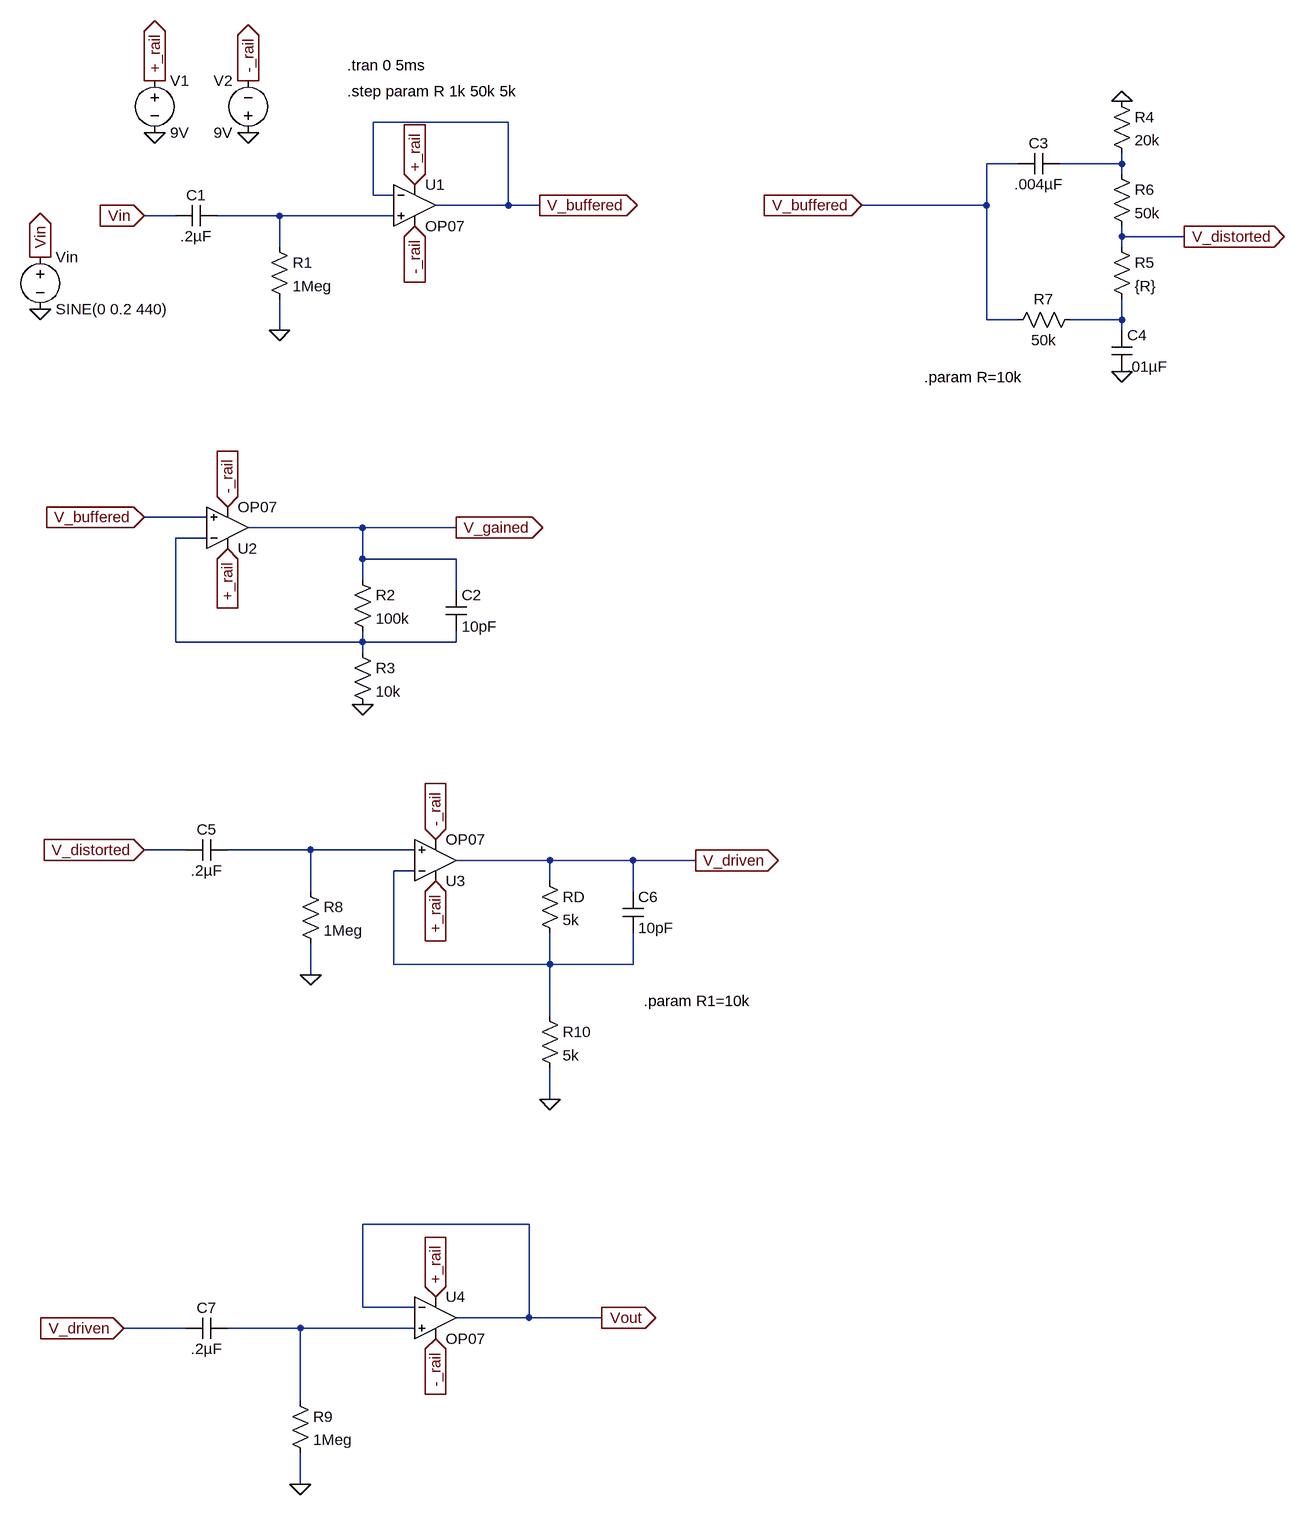
[diagram p0: schematic Overall Schematic.asc]
Overall Schematic.asc, the LTspice schematic file:
Version 4
SHEET 1 1952 2320
WIRE 736 208 528 208
WIRE 1520 272 1472 272
WIRE 1680 272 1680 256
WIRE 1680 272 1584 272
WIRE 1680 288 1680 272
WIRE 528 320 528 208
WIRE 560 320 528 320
WIRE 736 336 736 208
WIRE 736 336 624 336
WIRE 784 336 736 336
WIRE 1472 336 1472 272
WIRE 1472 336 1280 336
WIRE 224 352 176 352
WIRE 384 352 288 352
WIRE 560 352 384 352
WIRE 1680 384 1680 368
WIRE 1776 384 1680 384
WIRE 384 400 384 352
WIRE 1680 400 1680 384
WIRE 1472 512 1472 336
WIRE 1520 512 1472 512
WIRE 1680 512 1680 480
WIRE 1680 512 1600 512
WIRE 384 528 384 480
WIRE 1680 528 1680 512
WIRE 272 816 176 816
WIRE 512 832 336 832
WIRE 656 832 512 832
WIRE 272 848 224 848
WIRE 512 880 512 832
WIRE 656 880 512 880
WIRE 512 912 512 880
WIRE 656 928 656 880
WIRE 224 1008 224 848
WIRE 512 1008 512 992
WIRE 512 1008 224 1008
WIRE 656 1008 656 992
WIRE 656 1008 512 1008
WIRE 512 1024 512 1008
WIRE 240 1328 176 1328
WIRE 432 1328 304 1328
WIRE 592 1328 432 1328
WIRE 800 1344 656 1344
WIRE 928 1344 800 1344
WIRE 1024 1344 928 1344
WIRE 592 1360 560 1360
WIRE 800 1376 800 1344
WIRE 432 1392 432 1328
WIRE 928 1392 928 1344
WIRE 560 1504 560 1360
WIRE 800 1504 800 1456
WIRE 800 1504 560 1504
WIRE 928 1504 928 1456
WIRE 928 1504 800 1504
WIRE 432 1520 432 1472
WIRE 800 1584 800 1504
WIRE 800 1712 800 1664
WIRE 768 1904 512 1904
WIRE 512 2032 512 1904
WIRE 592 2032 512 2032
WIRE 768 2048 768 1904
WIRE 768 2048 656 2048
WIRE 880 2048 768 2048
WIRE 240 2064 144 2064
WIRE 416 2064 304 2064
WIRE 592 2064 416 2064
WIRE 416 2176 416 2064
WIRE 416 2304 416 2256
FLAG 384 528 0
FLAG 176 352 Vin
IOPIN 176 352 In
FLAG 192 224 0
FLAG 336 224 0
FLAG 192 144 +_rail
IOPIN 192 144 Out
FLAG 336 144 -_rail
IOPIN 336 144 Out
FLAG 592 304 +_rail
IOPIN 592 304 In
FLAG 592 368 -_rail
IOPIN 592 368 In
FLAG 784 336 V_buffered
IOPIN 784 336 Out
FLAG 16 496 0
FLAG 16 416 Vin
IOPIN 16 416 Out
FLAG 176 816 V_buffered
IOPIN 176 816 In
FLAG 304 800 -_rail
IOPIN 304 800 In
FLAG 304 864 +_rail
IOPIN 304 864 In
FLAG 512 1104 0
FLAG 656 832 V_gained
IOPIN 656 832 Out
FLAG 1280 336 V_buffered
IOPIN 1280 336 In
FLAG 1680 592 0
FLAG 1680 176 0
FLAG 1776 384 V_distorted
IOPIN 1776 384 Out
FLAG 176 1328 V_distorted
IOPIN 176 1328 In
FLAG 432 1520 0
FLAG 624 1376 +_rail
IOPIN 624 1376 In
FLAG 624 1312 -_rail
IOPIN 624 1312 In
FLAG 800 1712 0
FLAG 1024 1344 V_driven
IOPIN 1024 1344 Out
FLAG 144 2064 V_driven
IOPIN 144 2064 In
FLAG 624 2080 -_rail
IOPIN 624 2080 In
FLAG 624 2016 +_rail
IOPIN 624 2016 In
FLAG 416 2304 0
FLAG 880 2048 Vout
IOPIN 880 2048 Out
SYMBOL cap 288 336 R90
WINDOW 0 0 32 VBottom 2
WINDOW 3 32 32 VTop 2
SYMATTR InstName C1
SYMATTR Value .2µF
SYMBOL Res 368 384 R0
SYMATTR InstName R1
SYMATTR Value 1Meg
SYMBOL OpAmps/OP07 592 272 R0
SYMATTR InstName U1
SYMBOL Voltage 192 128 R0
SYMATTR InstName V1
SYMATTR Value 9V
SYMBOL Voltage 336 240 R180
WINDOW 0 24 96 Left 2
WINDOW 3 24 16 Left 2
SYMATTR InstName V2
SYMATTR Value 9V
SYMBOL Voltage 16 400 R0
SYMATTR InstName Vin
SYMATTR Value SINE(0 0.2 440)
SYMBOL OpAmps/OP07 304 896 M180
SYMATTR InstName U2
SYMBOL Res 496 896 R0
SYMATTR InstName R2
SYMATTR Value 100k
SYMBOL Res 496 1008 R0
SYMATTR InstName R3
SYMATTR Value 10k
SYMBOL Cap 640 928 R0
SYMATTR InstName C2
SYMATTR Value 10pF
SYMBOL Cap 1584 256 R90
WINDOW 0 0 32 VBottom 2
WINDOW 3 32 32 VTop 2
SYMATTR InstName C3
SYMATTR Value .004µF
SYMBOL Res 1616 496 R90
WINDOW 0 0 56 VBottom 2
WINDOW 3 32 56 VTop 2
SYMATTR InstName R7
SYMATTR Value 50k
SYMBOL Res 1664 384 R0
SYMATTR InstName R5
SYMATTR Value {R}
SYMBOL Res 1664 272 R0
SYMATTR InstName R6
SYMATTR Value 50k
SYMBOL Res 1664 160 R0
SYMATTR InstName R4
SYMATTR Value 20k
SYMBOL Cap 1664 528 R0
SYMATTR InstName C4
SYMATTR Value .01µF
SYMBOL cap 304 1312 R90
WINDOW 0 0 32 VBottom 2
WINDOW 3 32 32 VTop 2
SYMATTR InstName C5
SYMATTR Value .2µF
SYMBOL Res 416 1376 R0
SYMATTR InstName R8
SYMATTR Value 1Meg
SYMBOL OpAmps/OP07 624 1408 M180
SYMATTR InstName U3
SYMBOL Res 784 1360 R0
SYMATTR InstName RD
SYMATTR Value 5k
SYMBOL Cap 912 1392 R0
SYMATTR InstName C6
SYMATTR Value 10pF
SYMBOL Res 784 1568 R0
SYMATTR InstName R10
SYMATTR Value 5k
SYMBOL cap 304 2048 R90
WINDOW 0 0 32 VBottom 2
WINDOW 3 32 32 VTop 2
SYMATTR InstName C7
SYMATTR Value .2µF
SYMBOL Res 400 2160 R0
SYMATTR InstName R9
SYMATTR Value 1Meg
SYMBOL OpAmps/OP07 624 1984 R0
SYMATTR InstName U4
TEXT 488 120 Left 2 !.tran 0 5ms
TEXT 1376 600 Left 2 !.param R=10k
TEXT 488 160 Left 2 !.step param R 1k 50k 5k
TEXT 944 1560 Left 2 !.param R1=10k

The netlist it stands for:
* Overall Schematic.asc
C1 N002 Vin .2µF
R1 N002 0 1Meg
XU1 N002 V_buffered +_rail -_rail V_buffered LT1001  ; OP07, pins In+ In- V+ V- OUT
V1 +_rail 0 9V
V2 0 -_rail 9V
Vin Vin 0 SINE(0 0.2 440)
XU2 V_buffered N004 +_rail -_rail V_gained LT1001  ; OP07, pins In+ In- V+ V- OUT
R2 V_gained N004 100k
R3 N004 0 10k
C2 V_gained N004 10pF
C3 N001 V_buffered .004µF
R7 N003 V_buffered 50k
R5 V_distorted N003 {R}
R6 N001 V_distorted 50k
R4 0 N001 20k
C4 N003 0 .01µF
C5 N005 V_distorted .2µF
R8 N005 0 1Meg
XU3 N005 N006 +_rail -_rail V_driven LT1001  ; OP07, pins In+ In- V+ V- OUT
RD V_driven N006 5k
C6 V_driven N006 10pF
R10 N006 0 5k
C7 N007 V_driven .2µF
R9 N007 0 1Meg
XU4 N007 Vout +_rail -_rail Vout LT1001  ; OP07, pins In+ In- V+ V- OUT
.tran 0 5ms
.param R=10k
.step param R 1k 50k 5k
.param R1=10k
.lib LTC.lib
.backanno
.end